# EAGLE schematic Procesor-Atmega32u4 (EAGLE 9.1.0)
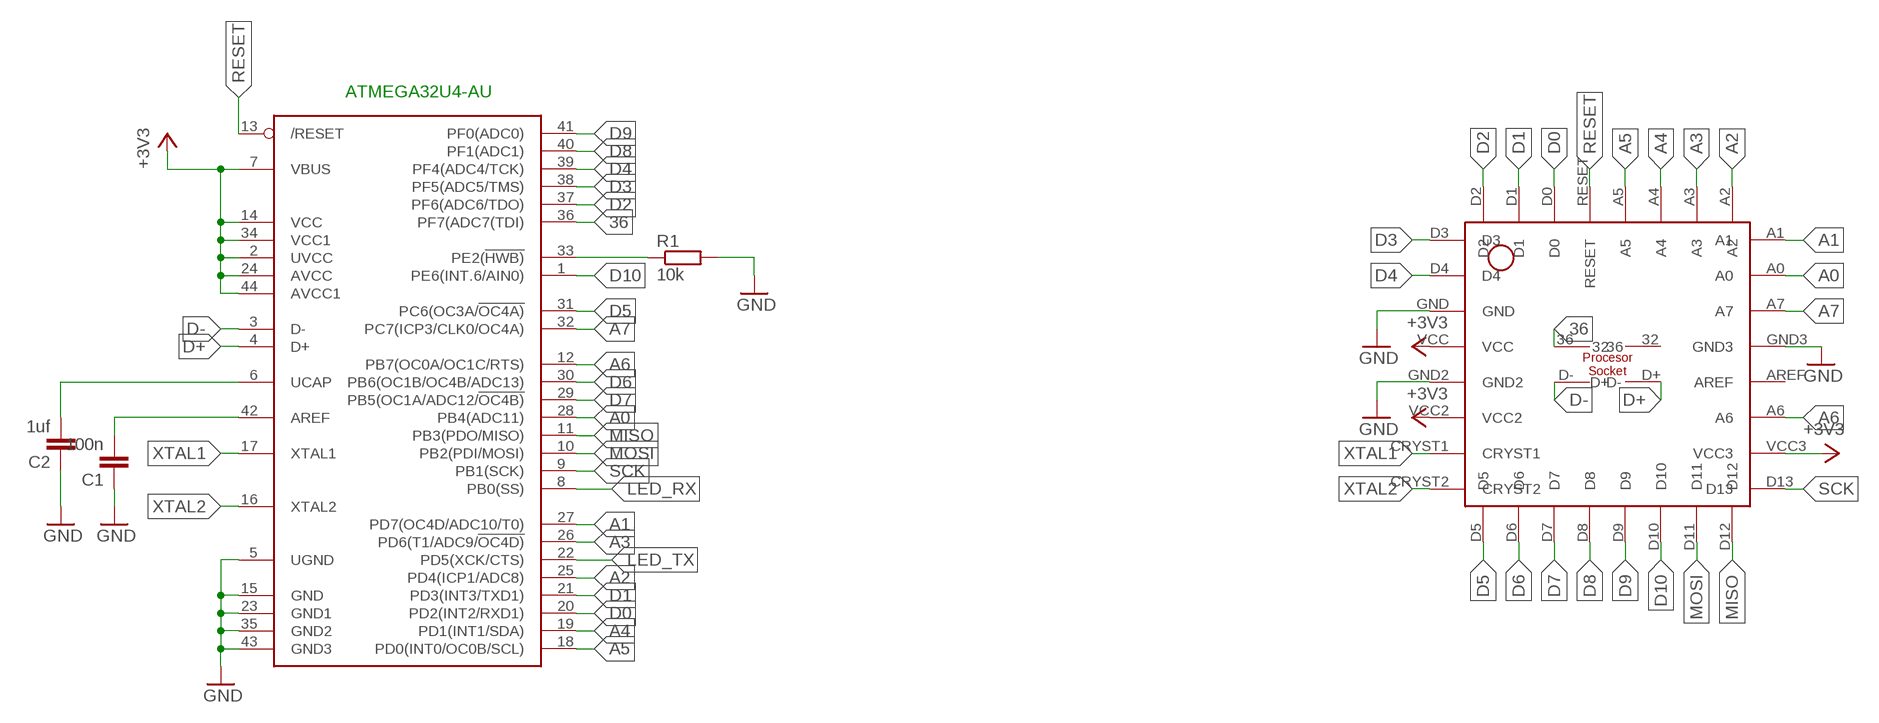
[diagram p0: schematic, sheet 1]

## Parts
ATMEGA32U4-AU  ATMEGA32U4-AU  [TQFP44]
C1  100n  C-EUC1206  [C1206]
C2  1uf  C-EUC1206K  [C1206K]
R1  10k  R-EU_R1206  [R1206]
U$2  PROCESSOR-SOCKET  [PROCESOR]

## Nets
36: ATMEGA32U4-AU.36(PF7(ADC7(TDI)) U$2.36
+3V3: ATMEGA32U4-AU.2(UVCC) ATMEGA32U4-AU.7(VBUS) ATMEGA32U4-AU.14(VCC) ATMEGA32U4-AU.24(AVCC) ATMEGA32U4-AU.34(VCC1) ATMEGA32U4-AU.44(AVCC1) U$2.VCC U$2.VCC2 U$2.VCC3
A0: ATMEGA32U4-AU.28(PB4(ADC11)) U$2.A0
A1: ATMEGA32U4-AU.27(PD7(OC4D/ADC10/T0)) U$2.A1
A2: ATMEGA32U4-AU.25(PD4(ICP1/ADC8)) U$2.A2
A3: ATMEGA32U4-AU.26(PD6(T1/ADC9/!OC4D)) U$2.A3
A4: ATMEGA32U4-AU.19(PD1(INT1/SDA)) U$2.A4
A5: ATMEGA32U4-AU.18(PD0(INT0/OC0B/SCL)) U$2.A5
A6: ATMEGA32U4-AU.12(PB7(OC0A/OC1C/RTS)) U$2.A6
A7: ATMEGA32U4-AU.32(PC7(ICP3/CLK0/OC4A)) U$2.A7
D0: ATMEGA32U4-AU.20(PD2(INT2/RXD1)) U$2.D0
D1: ATMEGA32U4-AU.21(PD3(INT3/TXD1)) U$2.D1
D2: ATMEGA32U4-AU.37(PF6(ADC6/TDO)) U$2.D2
D3: ATMEGA32U4-AU.38(PF5(ADC5/TMS)) U$2.D3
D4: ATMEGA32U4-AU.39(PF4(ADC4/TCK)) U$2.D4
D5: ATMEGA32U4-AU.31(PC6(OC3A/!OC4A)) U$2.D5
D6: ATMEGA32U4-AU.30(PB6(OC1B/OC4B/ADC13)) U$2.D6
D7: ATMEGA32U4-AU.29(PB5(OC1A/ADC12/!OC4B)) U$2.D7
D8: ATMEGA32U4-AU.40(PF1(ADC1)) U$2.D8
D9: ATMEGA32U4-AU.41(PF0(ADC0)) U$2.D9
D10: ATMEGA32U4-AU.1(PE6(INT.6/AIN0)) U$2.D10
D+: ATMEGA32U4-AU.4(D+) U$2.D+
D-: ATMEGA32U4-AU.3(D-) U$2.D-
GND: ATMEGA32U4-AU.5(UGND) ATMEGA32U4-AU.15(GND) ATMEGA32U4-AU.23(GND1) ATMEGA32U4-AU.35(GND2) ATMEGA32U4-AU.43(GND3) C1.1 C2.1 R1.2 U$2.GND U$2.GND2 U$2.GND3
LED_RX: ATMEGA32U4-AU.8(PB0(SS))
LED_TX: ATMEGA32U4-AU.22(PD5(XCK/CTS))
MISO: ATMEGA32U4-AU.11(PB3(PDO/MISO)) U$2.D12
MOSI: ATMEGA32U4-AU.10(PB2(PDI/MOSI)) U$2.D11
N$1: ATMEGA32U4-AU.42(AREF) C1.2
N$2: ATMEGA32U4-AU.6(UCAP) C2.2
N$6: ATMEGA32U4-AU.33(PE2(!HWB)) R1.1
RESET: ATMEGA32U4-AU.13(/RESET) U$2.RESET
SCK: ATMEGA32U4-AU.9(PB1(SCK)) U$2.D13
XTAL1: ATMEGA32U4-AU.17(XTAL1) U$2.CRYST1
XTAL2: ATMEGA32U4-AU.16(XTAL2) U$2.CRYST2
Unconnected: U$2.32 U$2.AREF

## Notes on the sheet
- ATMEGA32U4-AU

## Library data of the parts
ATMEGA32U4-AU = adafruit:ATMEGA32U4: http://www.ladyada.net/library/eagle
C1 C2 = rcl:C-EU: CAPACITOR, European symbol; SPICEPREFIX: C
R1 = rcl:R-EU_: RESISTOR, European symbol; SPICEPREFIX: R
U$2 = Cing Library:PROCESSOR-SOCKET